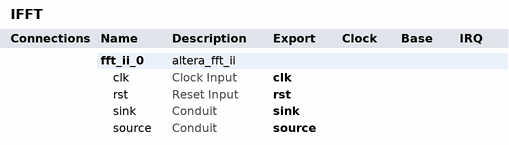
[diagram p0: system contents]
# Platform Designer (Qsys) system IFFT, Cyclone V 5CSEMA5F31C6
# Parameters at their usual value, and those the tool derives, are not listed.
package require -exact qsys 18.1
create_system IFFT
set_project_property DEVICE_FAMILY {Cyclone V}
set_project_property DEVICE 5CSEMA5F31C6

add_instance fft_ii_0 altera_fft_ii 18.1
set_instance_property fft_ii_0 AUTO_EXPORT true
set_instance_parameter_value fft_ii_0 data_flow Streaming
set_instance_parameter_value fft_ii_0 data_rep {Block Floating Point}
set_instance_parameter_value fft_ii_0 engine_arch {Quad Output}
set_instance_parameter_value fft_ii_0 in_width 8
set_instance_parameter_value fft_ii_0 length 64
set_instance_parameter_value fft_ii_0 out_order Natural
set_instance_parameter_value fft_ii_0 out_width 29
set_instance_parameter_value fft_ii_0 twid_width 8

# exported interfaces
add_interface clk clock sink
set_interface_property clk EXPORT_OF fft_ii_0.clk
add_interface rst reset sink
set_interface_property rst EXPORT_OF fft_ii_0.rst
add_interface sink conduit end
set_interface_property sink EXPORT_OF fft_ii_0.sink
add_interface source conduit end
set_interface_property source EXPORT_OF fft_ii_0.source

set_interconnect_requirement {$system} qsys_mm.clockCrossingAdapter HANDSHAKE
set_interconnect_requirement {$system} qsys_mm.enableEccProtection FALSE
set_interconnect_requirement {$system} qsys_mm.insertDefaultSlave FALSE
set_interconnect_requirement {$system} qsys_mm.maxAdditionalLatency 1

save_system IFFT.qsys
